# EAGLE schematic mixer (EAGLE 9.6.2)
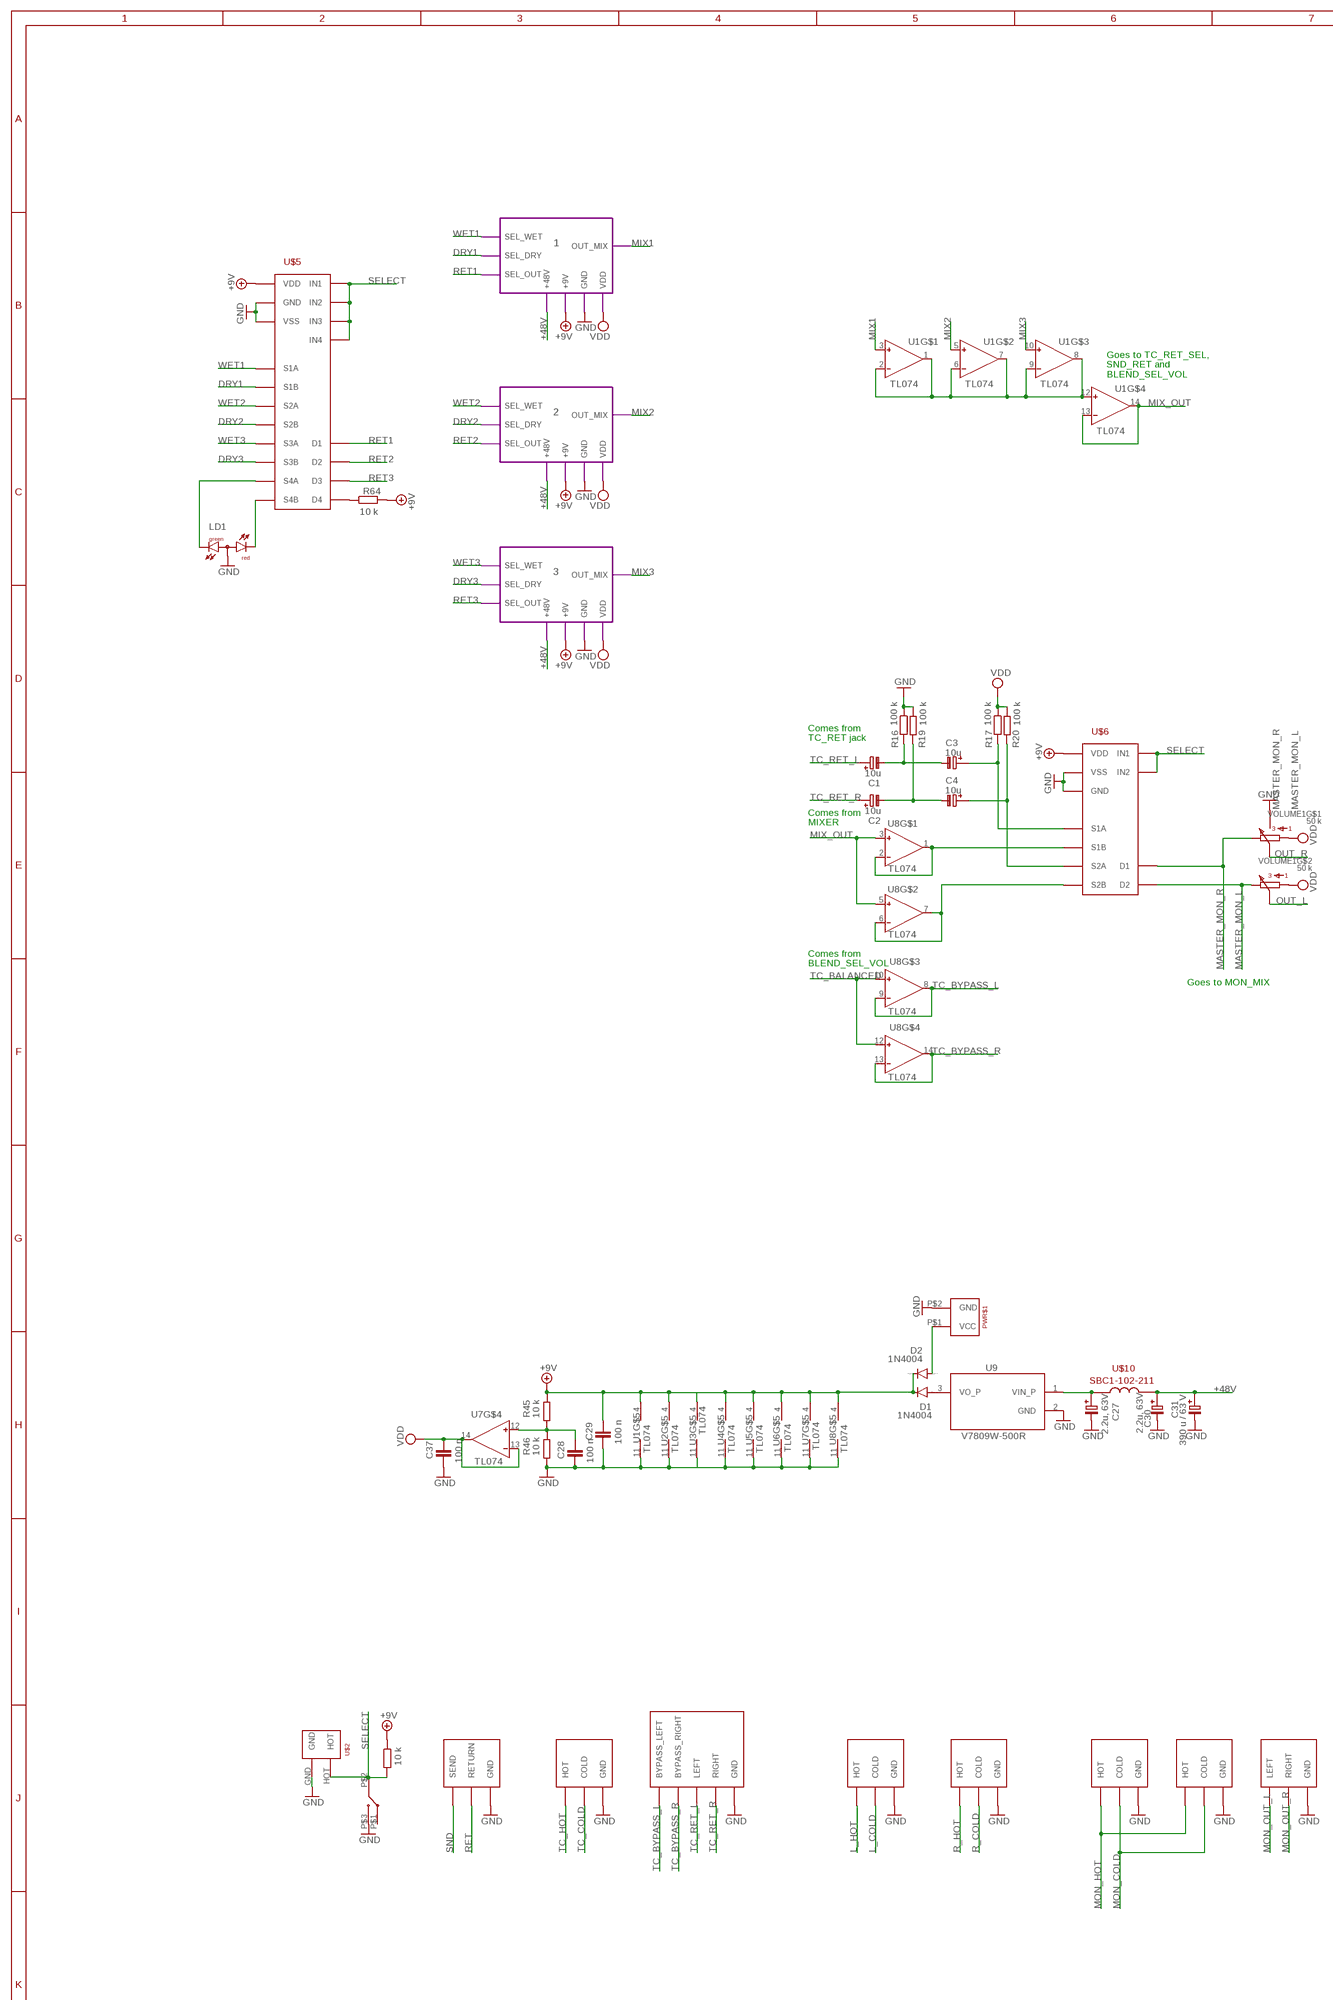
[diagram p0: schematic, sheet 1, part 1 of 3]
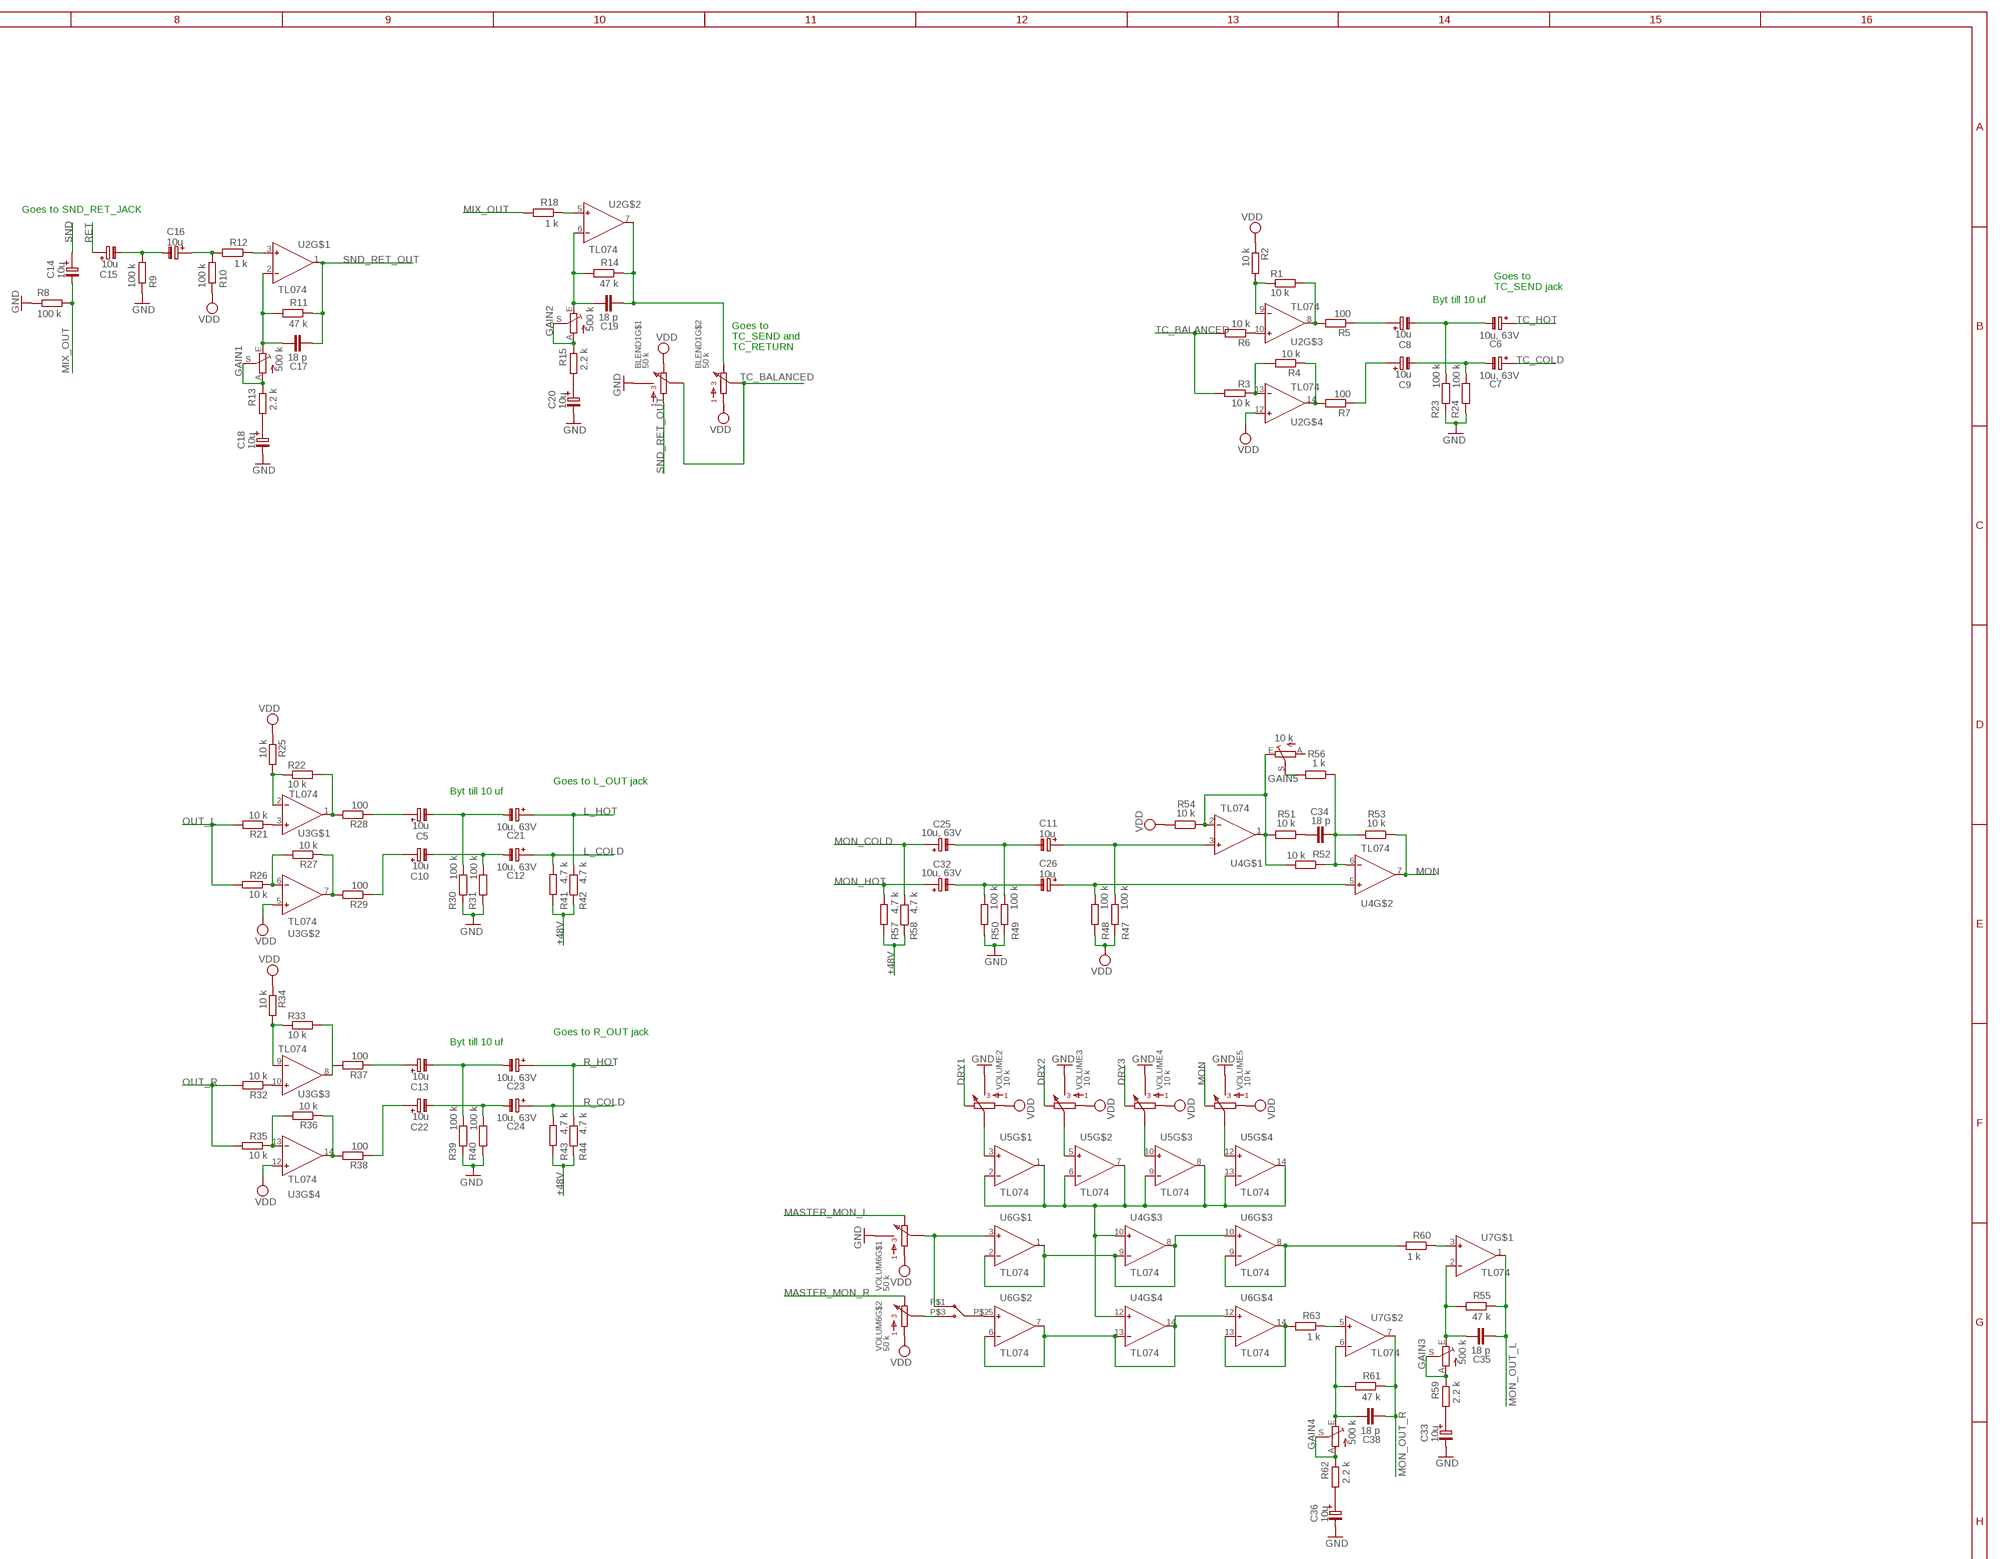
[diagram p1: schematic, sheet 1, part 2 of 3]
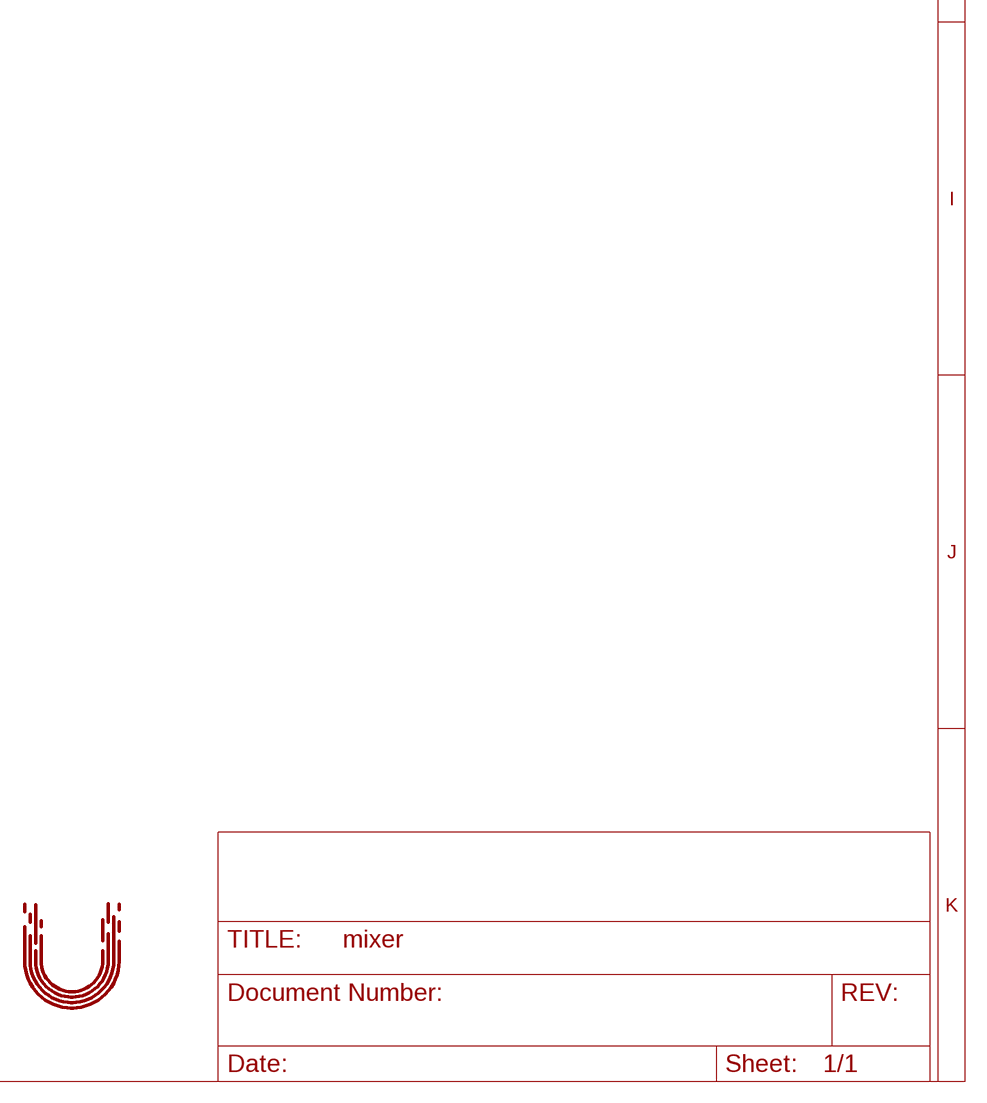
[diagram p2: schematic, sheet 1, part 3 of 3]

## Parts
BLEND1  50 k  RK09L124000Z  [RK09L124000Z]
BYPASS  BUTTON  [3-HOLES]
C1  10u  C-PR-2,0X5  [E2,0-5]
C2  10u  C-PR-2,0X5  [E2,0-5]
C3  10u  C-PR-2,0X5  [E2,0-5]
C4  10u  C-PR-2,0X5  [E2,0-5]
C5  10u  C-PR-2,0X5  [E2,0-5]
C6  10u, 63V  C-PR-2,0X6  [E2,0-6]
C7  10u, 63V  C-PR-2,0X6  [E2,0-6]
C8  10u  C-PR-2,0X5  [E2,0-5]
C9  10u  C-PR-2,0X5  [E2,0-5]
C10  10u  C-PR-2,0X5  [E2,0-5]
C11  10u  C-PR-2,0X5  [E2,0-5]
C12  10u, 63V  C-PR-2,0X6  [E2,0-6]
C13  10u  C-PR-2,0X5  [E2,0-5]
C14  10u  C-PR-2,0X5  [E2,0-5]
C15  10u  C-PR-2,0X5  [E2,0-5]
C16  10u  C-PR-2,0X5  [E2,0-5]
C17  18 p  C-EU025-025X050  [C025-025X050]
C18  10u  C-PR-2,0X5  [E2,0-5]
C19  18 p  C-EU025-025X050  [C025-025X050]
C20  10u  C-PR-2,0X5  [E2,0-5]
C21  10u, 63V  C-PR-2,0X6  [E2,0-6]
C22  10u  C-PR-2,0X5  [E2,0-5]
C23  10u, 63V  C-PR-2,0X6  [E2,0-6]
C24  10u, 63V  C-PR-2,0X6  [E2,0-6]
C25  10u, 63V  C-PR-2,0X6  [E2,0-6]
C26  10u  C-PR-2,0X5  [E2,0-5]
C27  2.2u, 63V  C-PR-2,0X6  [E2,0-6]
C28  100 n  C-EU025-025X050  [C025-025X050]
C29  100 n  C-EU025-025X050  [C025-025X050]
C30  2.2u, 63V  C-PR-2,0X6  [E2,0-6]
C31  390 u / 63 V  C-PR-5,0X12,5  [E5,0-12,5]
C32  10u, 63V  C-PR-2,0X6  [E2,0-6]
C33  10u  C-PR-2,0X5  [E2,0-5]
C34  18 p  C-EU025-025X050  [C025-025X050]
C35  18 p  C-EU025-025X050  [C025-025X050]
C36  10u  C-PR-2,0X5  [E2,0-5]
C37  100 n  C-EU025-025X050  [C025-025X050]
C38  18 p  C-EU025-025X050  [C025-025X050]
D1  1N4004  [DO41-10]
D2  1N4004  [DO41-10]
GAIN1  500 k  TRIM_EU-RJ9W  [RJ9W]
GAIN2  500 k  TRIM_EU-RJ9W  [RJ9W]
GAIN3  500 k  TRIM_EU-RJ9W  [RJ9W]
GAIN4  500 k  TRIM_EU-RJ9W  [RJ9W]
GAIN5  10 k  TRIM_EU-RJ9W  [RJ9W]
LD1  DUOLED-RG-A  [DUOLED-A-5MM]
LOOPMASTER  SEND_RETURN  [SND_RET]
MON_IN  HOT_COLD  [HOT_COLD]
MON_OUT  LEFT_RIGHT  [LEFT_RIGHT]
MON_THROUGH  HOT_COLD  [HOT_COLD]
MONO  BUTTON  [3-HOLES]
OUT_L  HOT_COLD  [HOT_COLD]
OUT_R  HOT_COLD  [HOT_COLD]
PWR$1  PWR  [PWR]
R1  10 k  R-EU_0204/7  [0204/7]
R2  10 k  R-EU_0204/7  [0204/7]
R3  10 k  R-EU_0204/7  [0204/7]
R4  10 k  R-EU_0204/7  [0204/7]
R5  100  R-EU_0204/7  [0204/7]
R6  10 k  R-EU_0204/7  [0204/7]
R7  100  R-EU_0204/7  [0204/7]
R8  100 k  R-EU_0204/7  [0204/7]
R9  100 k  R-EU_0204/7  [0204/7]
R10  100 k  R-EU_0204/7  [0204/7]
R11  47 k  R-EU_0204/7  [0204/7]
R12  1 k  R-EU_0204/7  [0204/7]
R13  2.2 k  R-EU_0204/7  [0204/7]
R14  47 k  R-EU_0204/7  [0204/7]
R15  2.2 k  R-EU_0204/7  [0204/7]
R16  100 k  R-EU_0204/7  [0204/7]
R17  100 k  R-EU_0204/7  [0204/7]
R18  1 k  R-EU_0204/7  [0204/7]
R19  100 k  R-EU_0204/7  [0204/7]
R20  100 k  R-EU_0204/7  [0204/7]
R21  10 k  R-EU_0204/7  [0204/7]
R22  10 k  R-EU_0204/7  [0204/7]
R23  100 k  R-EU_0204/7  [0204/7]
R24  100 k  R-EU_0204/7  [0204/7]
R25  10 k  R-EU_0204/7  [0204/7]
R26  10 k  R-EU_0204/7  [0204/7]
R27  10 k  R-EU_0204/7  [0204/7]
R28  100  R-EU_0204/7  [0204/7]
R29  100  R-EU_0204/7  [0204/7]
R30  100 k  R-EU_0204/7  [0204/7]
R31  100 k  R-EU_0204/7  [0204/7]
R32  10 k  R-EU_0204/7  [0204/7]
R33  10 k  R-EU_0204/7  [0204/7]
R34  10 k  R-EU_0204/7  [0204/7]
R35  10 k  R-EU_0204/7  [0204/7]
R36  10 k  R-EU_0204/7  [0204/7]
R37  100  R-EU_0204/7  [0204/7]
R38  100  R-EU_0204/7  [0204/7]
R39  100 k  R-EU_0204/7  [0204/7]
R40  100 k  R-EU_0204/7  [0204/7]
R41  4.7 k  R-EU_0204/7  [0204/7]
R42  4.7 k  R-EU_0204/7  [0204/7]
R43  4.7 k  R-EU_0204/7  [0204/7]
R44  4.7 k  R-EU_0204/7  [0204/7]
R45  10 k  R-EU_0204/7  [0204/7]
R46  10 k  R-EU_0204/7  [0204/7]
R47  100 k  R-EU_0204/7  [0204/7]
R48  100 k  R-EU_0204/7  [0204/7]
R49  100 k  R-EU_0204/7  [0204/7]
R50  100 k  R-EU_0204/7  [0204/7]
R51  10 k  R-EU_0204/7  [0204/7]
R52  10 k  R-EU_0204/7  [0204/7]
R53  10 k  R-EU_0204/7  [0204/7]
R54  10 k  R-EU_0204/7  [0204/7]
R55  47 k  R-EU_0204/7  [0204/7]
R56  1 k  R-EU_0204/7  [0204/7]
R57  4.7 k  R-EU_0204/7  [0204/7]
R58  4.7 k  R-EU_0204/7  [0204/7]
R59  2.2 k  R-EU_0204/7  [0204/7]
R60  1 k  R-EU_0204/7  [0204/7]
R61  47 k  R-EU_0204/7  [0204/7]
R62  2.2 k  R-EU_0204/7  [0204/7]
R63  1 k  R-EU_0204/7  [0204/7]
R64  10 k  R-EU_0204/7  [0204/7]
R65  10 k  R-EU_0204/7  [0204/7]
TC_RET  LEFT_RIGHT_BYPASS  [LEFT_RIGHT_BYPASS]
TC_SEND_JACK  HOT_COLD  [HOT_COLD]
U1  TL074  TL074IDTPDIP-14  [DIP762W53P254L1969H508Q14B]
U2  TL074  TL074IDTPDIP-14  [DIP762W53P254L1969H508Q14B]
U3  TL074  TL074IDTPDIP-14  [DIP762W53P254L1969H508Q14B]
U4  TL074  TL074IDTPDIP-14  [DIP762W53P254L1969H508Q14B]
U5  TL074  TL074IDTPDIP-14  [DIP762W53P254L1969H508Q14B]
U6  TL074  TL074IDTPDIP-14  [DIP762W53P254L1969H508Q14B]
U7  TL074  TL074IDTPDIP-14  [DIP762W53P254L1969H508Q14B]
U8  TL074  TL074IDTPDIP-14  [DIP762W53P254L1969H508Q14B]
U9  V7809W-500R  [CONV_V7809W-500R]
U$1  UTBULT_DESIGN3  [UD_3]
U$2  UNBALANCED_INPUT_JACK  [BALANCED_INPUT_JACK]
U$5  ADG333ABNZADG333ABNZ  [DIP762W53P254L2591H508Q20B]
U$6  ADG436BNZADG436BNZ  [DIP762W53P254L2006H508Q16B]
U$10  SBC1-102-211  [SBC1-102-211]
VOLUM6  50 k  RK09L124000Z  [RK09L124000Z]
VOLUME1  50 k  RK09L124000Z  [RK09L124000Z]
VOLUME2  10 k  RK09L1140  [RK09L1140]
VOLUME3  10 k  RK09L1140  [RK09L1140]
VOLUME4  10 k  RK09L1140  [RK09L1140]
VOLUME5  10 k  RK09L1140  [RK09L1140]

## Module instances
1 = C
2 = C
3 = C

## Nets
+9V: C29.1 D1.C D2.C R45.1 R64.2 R65.1 U1.4(V+) U2.4(V+) U3.4(V+) U4.4(V+) U5.4(V+) U6.4(V+) U7.4(V+) U8.4(V+) U$5.VDD U$6.VDD ; port 1.+9V 2.+9V 3.+9V
+48V: C30.+ C31.+ R41.1 R42.1 R43.1 R44.1 R57.1 R58.1 U$10.P$2 ; port 1.+48V 2.+48V 3.+48V
COLD_SEND: C11.+ R47.2 U4.3(IN+)
DRY1: U$5.S1B VOLUME2.P$3 ; port 1.SEL_DRY
DRY2: U$5.S2B VOLUME3.P$3 ; port 2.SEL_DRY
DRY3: U$5.S3B VOLUME4.P$3 ; port 3.SEL_DRY
GND: BLEND1.P$4 BLEND1.P$5 BYPASS.P$3 C18.- C20.- C27.- C28.2 C29.2 C30.- C31.- C33.- C36.- C37.2 LD1.A LOOPMASTER.P$1(GND) MON_IN.P$1(GND) MON_OUT.P$1(GND) MON_THROUGH.P$1(GND) OUT_L.P$1(GND) OUT_R.P$1(GND) PWR$1.P$2(GND) R8.1 R9.1 R16.1 R19.1 R23.1 R24.1 R30.1 R31.1 R39.1 R40.1 R46.2 R49.1 R50.1 TC_RET.GND TC_SEND_JACK.P$1(GND) U1.11(V-) U2.11(V-) U3.11(V-) U4.11(V-) U5.11(V-) U6.11(V-) U7.11(V-) U8.11(V-) U9.2(GND) U$2.GND U$5.GND U$5.VSS U$6.GND U$6.VSS VOLUM6.P$4 VOLUM6.P$5 VOLUME1.P$4 VOLUME1.P$5 VOLUME2.P$4 VOLUME2.P$5 VOLUME3.P$4 VOLUME3.P$5 VOLUME4.P$4 VOLUME4.P$5 VOLUME5.P$4 VOLUME5.P$5 ; port 1.GND 2.GND 3.GND
HOT_SEND: C26.+ R48.2 U4.5(IN+)
L_COLD: C12.+ OUT_L.P$3(COLD) R41.2
L_HOT: C21.+ OUT_L.P$2(HOT) R42.2
MASTER_MON_L: U$6.D2 VOLUM6.P$3 VOLUME1.P$8
MASTER_MON_R: U$6.D1 VOLUM6.P$8 VOLUME1.P$3
MIX1: U1.3(IN+) ; port 1.OUT_MIX
MIX2: U1.5(IN+) ; port 2.OUT_MIX
MIX3: U1.10(IN+) ; port 3.OUT_MIX
MIX_OUT: C14.- R8.2 R18.2 U1.13(IN-) U1.14(OUT) U8.3(IN+) U8.5(IN+)
MON: R53.1 U4.7(OUT) VOLUME5.P$3
MON_COLD: C25.+ MON_IN.P$3(COLD) MON_THROUGH.P$3(COLD) R58.2
MON_HOT: C32.+ MON_IN.P$2(HOT) MON_THROUGH.P$2(HOT) R57.2
MON_OUT_L: C35.1 MON_OUT.P$2(LEFT) R55.1 U7.1(OUT)
MON_OUT_R: C38.1 MON_OUT.P$3(RIGHT) R61.1 U7.7(OUT)
N$1: R1.1 R2.2 U2.9(IN-)
N$2: R6.1 U2.10(IN+)
N$3: R1.2 R5.2 U2.8(OUT)
N$4: U1.1(OUT) U1.2(IN-) U1.6(IN-) U1.7(OUT) U1.8(OUT) U1.9(IN-) U1.12(IN+)
N$5: R3.1 R4.2 U2.13(IN-)
N$6: R4.1 R7.2 U2.14(OUT)
N$7: C8.+ R5.1
N$8: C9.+ R7.1
N$9: C1.- C3.- R16.2
N$10: R21.1 U3.3(IN+)
N$12: C2.- C4.- R19.2
N$13: R22.2 R28.2 U3.1(OUT)
N$14: C6.- C8.- R23.2
N$15: C7.- C9.- R24.2
N$16: R22.1 R25.2 U3.2(IN-)
N$17: R26.1 R27.2 U3.6(IN-)
N$18: R27.1 R29.2 U3.7(OUT)
N$19: C5.- C21.- R30.2
N$20: C10.- C12.- R31.2
N$21: C5.+ R28.1
N$22: C10.+ R29.1
N$23: GAIN1.A GAIN1.S R13.1
N$24: R32.1 U3.10(IN+)
N$25: C11.- C25.- R49.2
N$26: C15.- C16.- R9.2
N$27: C26.- C32.- R50.2
N$28: C16.+ R10.2 R12.2
N$29: C17.2 GAIN1.E R11.2 U2.2(IN-)
N$30: C19.2 GAIN2.E R14.2 U2.6(IN-)
N$31: GAIN2.A GAIN2.S R15.1
N$32: C18.+ R13.2
N$33: R12.1 U2.3(IN+)
N$34: GAIN4.A GAIN4.S R62.1
N$35: C20.+ R15.2
N$36: R18.1 U2.5(IN+)
N$37: BLEND1.P$8 C19.1 R14.1 U2.7(OUT)
N$38: R33.2 R37.2 U3.8(OUT)
N$39: R33.1 R34.2 U3.9(IN-)
N$40: R35.1 R36.2 U3.13(IN-)
N$41: R36.1 R38.2 U3.14(OUT)
N$42: C13.- C23.- R39.2
N$43: C22.- C24.- R40.2
N$44: C13.+ R37.1
N$45: C22.+ R38.1
N$46: GAIN5.E R51.2 R52.2 R54.1 U4.1(OUT) U4.2(IN-)
N$47: C34.1 R51.1
N$48: C34.2 R52.1 R53.2 R56.1 U4.6(IN-)
N$49: U4.8(OUT) U4.9(IN-) U6.1(OUT) U6.2(IN-) U6.10(IN+)
N$50: GAIN5.S R56.2
N$51: MONO.P$1 U6.3(IN+) VOLUM6.P$2
N$52: U4.13(IN-) U4.14(OUT) U6.6(IN-) U6.7(OUT) U6.12(IN+)
N$53: U5.3(IN+) VOLUME2.P$2
N$54: U5.5(IN+) VOLUME3.P$2
N$55: U5.10(IN+) VOLUME4.P$2
N$56: U5.12(IN+) VOLUME5.P$2
N$57: U4.10(IN+) U4.12(IN+) U5.1(OUT) U5.2(IN-) U5.6(IN-) U5.7(OUT) U5.8(OUT) U5.9(IN-) U5.13(IN-) U5.14(OUT)
N$58: MONO.P$2 U6.5(IN+)
N$59: R63.2 U6.13(IN-) U6.14(OUT)
N$60: R60.2 U6.8(OUT) U6.9(IN-)
N$62: GAIN3.A GAIN3.S R59.1
N$63: C33.+ R59.2
N$64: R60.1 U7.3(IN+)
N$65: U8.1(OUT) U8.2(IN-) U$6.S1B
N$66: C38.2 GAIN4.E R61.2 U7.6(IN-)
N$67: C35.2 GAIN3.E R55.2 U7.2(IN-)
N$68: C36.+ R62.2
N$69: R63.1 U7.5(IN+)
N$70: D1.A U9.3(VO_P)
N$71: U8.6(IN-) U8.7(OUT) U$6.S2B
N$72: MONO.P$3 VOLUM6.P$7
N$73: C28.1 R45.2 R46.1 U7.12(IN+)
N$74: LD1.CR U$5.S4B
N$75: LD1.CX(CG) U$5.S4A
N$76: R64.1 U$5.D4
N$79: C27.+ U9.1(VIN_P) U$10.P$1
N$81: D2.A PWR$1.P$1(VCC)
OUT_L: R21.2 R26.2 VOLUME1.P$7
OUT_R: R32.2 R35.2 VOLUME1.P$2
R_COLD: C24.+ OUT_R.P$3(COLD) R43.2
R_HOT: C23.+ OUT_R.P$2(HOT) R44.2
RET: C15.+ LOOPMASTER.P$2(RETURN)
RET1: U$5.D1 ; port 1.SEL_OUT
RET2: U$5.D2 ; port 2.SEL_OUT
RET3: U$5.D3 ; port 3.SEL_OUT
SELECT: BYPASS.P$2 R65.2 U$2.HOT U$5.IN1 U$5.IN2 U$5.IN3 U$5.IN4 U$6.IN1 U$6.IN2
SND: C14.+ LOOPMASTER.P$3(SEND)
SND_RET_OUT: BLEND1.P$1 C17.1 R11.1 U2.1(OUT)
TC_BALANCED: BLEND1.P$2 BLEND1.P$7 R3.2 R6.2 U8.10(IN+) U8.12(IN+)
TC_BYPASS_L: TC_RET.BPSR(BYPASS_LEFT) U8.8(OUT) U8.9(IN-)
TC_BYPASS_R: TC_RET.BPSL(BYPASS_RIGHT) U8.13(IN-) U8.14(OUT)
TC_COLD: C7.+ TC_SEND_JACK.P$3(COLD)
TC_HOT: C6.+ TC_SEND_JACK.P$2(HOT)
TC_RET_L: C1.+ TC_RET.LEFT
TC_RET_R: C2.+ TC_RET.RIGHT
TC_WET_L: C3.+ R17.2 U$6.S1A
TC_WET_R: C4.+ R20.2 U$6.S2A
VDD: BLEND1.P$3 BLEND1.P$6 C37.1 R2.1 R10.1 R17.1 R20.1 R25.1 R34.1 R47.1 R48.1 R54.2 U2.12(IN+) U3.5(IN+) U3.12(IN+) U7.13(IN-) U7.14(OUT) VOLUM6.P$1 VOLUM6.P$6 VOLUME1.P$1 VOLUME1.P$6 VOLUME2.P$1 VOLUME3.P$1 VOLUME4.P$1 VOLUME5.P$1 ; port 1.VDD 2.VDD 3.VDD
WET1: U$5.S1A ; port 1.SEL_WET
WET2: U$5.S2A ; port 2.SEL_WET
WET3: U$5.S3A ; port 3.SEL_WET
Unconnected: BYPASS.P$1 GAIN5.A U7.8(OUT) U7.9(IN-) U7.10(IN+)

## Notes on the sheet
- Goes to SND_RET_JACK
- Goes to 
  TC_SEND jack
- Byt till 10 uf
- Goes to 
  TC_SEND and
  TC_RETURN
- Goes to TC_RET_SEL,
  SND_RET and 
  BLEND_SEL_VOL
- Goes to L_OUT jack
- Comes from
  TC_RET jack
- Byt till 10 uf
- Comes from
  MIXER
- Comes from
  BLEND_SEL_VOL
- Goes to R_OUT jack
- Goes to MON_MIX | Byt till 10 uf

## Library data of the parts
BLEND1 VOLUME1 = passives:RK09L124000Z: RK09L1140 Potentiometer; LINK: https://www.mouser.se/ProductDetail/Alps-Alpine/RK09L124000Z?qs=fQ8kcZGzY5XvGyzlPd%2FK1w%3D%3D
BYPASS MONO = connectors:BUTTON
C1-C16 C18 C20-C27 C30-C33 C36 = passives:C-PR: POLARIZED ELECTROLYTIC/TANTALUM
C17 C19 C28 C29 C34 C35 C37 C38 = passives:C-EU: CAPACITOR, European symbol; SPICEPREFIX: C
D1 D2 = passives:1N4004: DIODE general purpose rectifier, 1 A
GAIN1-GAIN5 = passives:TRIM_EU-: POTENTIOMETER
LD1 = passives:DUOLED-RG-A: DUO LED 2 colors (red/green), 5 mm, round, common Anode www.ligitek.com or other producers.
LOOPMASTER = connectors:SEND_RETURN
MON_IN MON_THROUGH OUT_L OUT_R TC_SEND_JACK = connectors:HOT_COLD
MON_OUT = connectors:LEFT_RIGHT
PWR$1 = connectors:PWR
R1-R65 = passives:R-EU_: RESISTOR, European symbol; SPICEPREFIX: R
TC_RET = connectors:LEFT_RIGHT_BYPASS
U1-U8 = ic:TL074IDT: Low noise JFET quad operational amplifier; LINK: https://eu.mouser.com/ProductDetail/Texas-Instruments/TL074CN?qs=%2Fha2pyFadui04%2FQQ4Z%2F%252B8cpHvrlLCfjGhhp9sdrT5Zo%3D; MPN: TL074CN; SUPPLIER: Mouser
U9 = power:V7809W-500R: V7809W-500R Power regulator Input up to 72 V, output 9 V 500 mA; LINK: https://eu.mouser.com/ProductDetail/CUI-Inc/V7809W-500R?qs=WyjlAZoYn50ZQqVm%2FTcinw%3D%3D; MPN: V7809W-500R; SUPPLIER: Mouser
U$1 = misc:UTBULT_DESIGN
U$2 = connectors:UNBALANCED_INPUT_JACK
U$5 = ic:ADG333ABNZ: ADG333ABNZ Analog selector 4 channel, +-44 V Connects B on logical 0, and A on logical 1; LINK: https://www.mouser.se/ProductDetail/Analog-Devices/ADG333ABNZ?qs=BpaRKvA4VqF%252BfFFtqT1yFg%3D%3D; MPN: ADG333ABNZ; SUPPLIER: Mouser
U$6 = ic:ADG436BNZ: ADG436BNZ Analog selector 2 channel, +-44 V Connects B on logical 0, and A on logical 1
U$10 = passives:SBC1-102-211: SBC1-102-211 - Inductor 1 mH 210 mA
VOLUM6 = passives:RK09L124000Z: RK09L1140 Potentiometer
VOLUME2-VOLUME5 = passives:RK09L1140: RK09L1140 Potentiometer

## Module C
Ports: SEL_WET(io) SEL_DRY(io) SEL_OUT(io) OUT_MIX(io) VDD(io) GND(io) +9V(io) +48V(io)
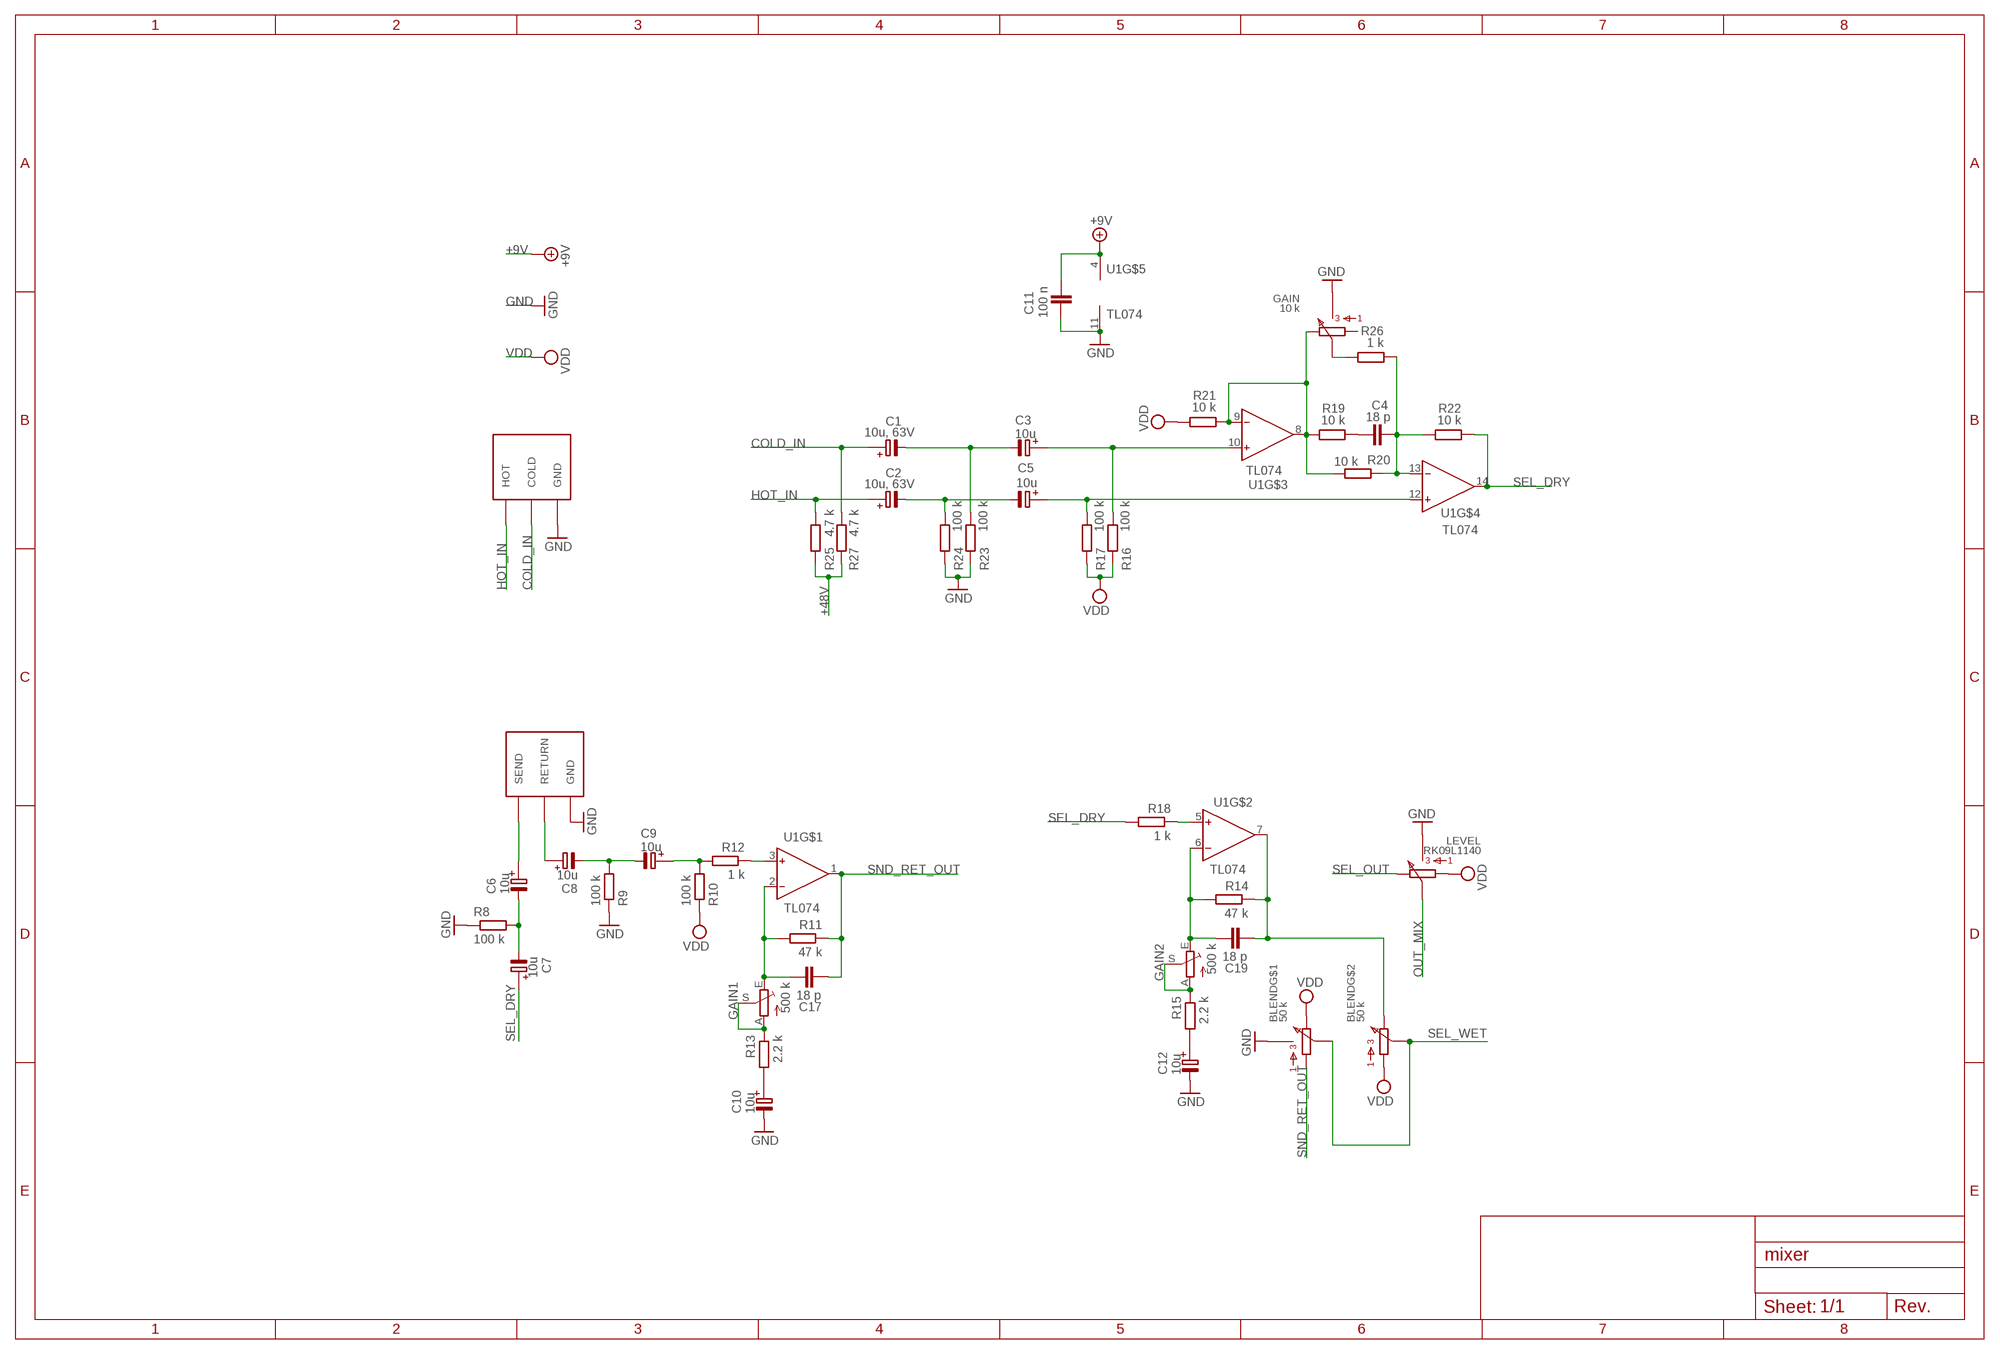
[diagram p3: schematic, module C, sheet 1]

### Parts
BLEND  50 k  RK09L124000Z  [RK09L124000Z]
C1  10u, 63V  C-PR-2,0X6  [E2,0-6]
C2  10u, 63V  C-PR-2,0X6  [E2,0-6]
C3  10u  C-PR-2,0X5  [E2,0-5]
C4  18 p  C-EU025-025X050  [C025-025X050]
C5  10u  C-PR-2,0X5  [E2,0-5]
C6  10u  C-PR-2,0X5  [E2,0-5]
C7  10u  C-PR-2,0X5  [E2,0-5]
C8  10u  C-PR-2,0X5  [E2,0-5]
C9  10u  C-PR-2,0X5  [E2,0-5]
C10  10u  C-PR-2,0X5  [E2,0-5]
C11  100 n  C-EU025-025X050  [C025-025X050]
C12  10u  C-PR-2,0X5  [E2,0-5]
C17  18 p  C-EU025-025X050  [C025-025X050]
C19  18 p  C-EU025-025X050  [C025-025X050]
GAIN  10 k  RK09L1140  [RK09L1140]
GAIN1  500 k  TRIM_EU-RJ9W  [RJ9W]
GAIN2  500 k  TRIM_EU-RJ9W  [RJ9W]
IN  HOT_COLD  [HOT_COLD]
LEVEL  RK09L1140  [RK09L1140]
R8  100 k  R-EU_0204/7  [0204/7]
R9  100 k  R-EU_0204/7  [0204/7]
R10  100 k  R-EU_0204/7  [0204/7]
R11  47 k  R-EU_0204/7  [0204/7]
R12  1 k  R-EU_0204/7  [0204/7]
R13  2.2 k  R-EU_0204/7  [0204/7]
R14  47 k  R-EU_0204/7  [0204/7]
R15  2.2 k  R-EU_0204/7  [0204/7]
R16  100 k  R-EU_0204/7  [0204/7]
R17  100 k  R-EU_0204/7  [0204/7]
R18  1 k  R-EU_0204/7  [0204/7]
R19  10 k  R-EU_0204/7  [0204/7]
R20  10 k  R-EU_0204/7  [0204/7]
R21  10 k  R-EU_0204/7  [0204/7]
R22  10 k  R-EU_0204/7  [0204/7]
R23  100 k  R-EU_0204/7  [0204/7]
R24  100 k  R-EU_0204/7  [0204/7]
R25  4.7 k  R-EU_0204/7  [0204/7]
R26  1 k  R-EU_0204/7  [0204/7]
R27  4.7 k  R-EU_0204/7  [0204/7]
U1  TL074  TL074IDTPDIP-14  [DIP762W53P254L1969H508Q14B]
U2  SEND_RETURN  [SND_RET]

### Nets
+9V: C11.2 U1.4(V+)
+48V: R25.1 R27.1
COLD_IN: C1.+ IN.P$3(COLD) R27.2
COLD_SEND: C3.+ R16.2 U1.10(IN+)
GND: BLEND.P$4 BLEND.P$5 C10.- C12.- GAIN.P$4 GAIN.P$5 IN.P$1(GND) LEVEL.P$4 LEVEL.P$5 R8.1 R9.1 R23.1 R24.1 U2.P$1(GND)
HOT_IN: C2.+ IN.P$2(HOT) R25.2
HOT_SEND: C5.+ R17.2 U1.12(IN+)
N$1: C10.+ R13.2
N$2: C12.+ R15.2
N$3: GAIN1.A GAIN1.S R13.1
N$4: GAIN2.A GAIN2.S R15.1
N$9: GAIN.P$3 R19.2 R20.2 R21.1 U1.8(OUT) U1.9(IN-)
N$11: C4.1 R19.1
N$12: C4.2 R20.1 R22.2 R26.1 U1.13(IN-)
N$14: C1.- C3.- R23.2
N$15: C2.- C5.- R24.2
N$17: GAIN.P$2 R26.2
N$23: C6.- C7.- R8.2
N$24: C11.1 U1.11(V-) ; supply symbol labelled GND
N$25: C6.+ U2.P$3(SEND)
N$26: C8.- C9.- R9.2
N$27: C8.+ U2.P$2(RETURN)
N$28: C9.+ R10.2 R12.2
N$29: C17.2 GAIN1.E R11.2 U1.2(IN-)
N$30: C19.2 GAIN2.E R14.2 U1.6(IN-)
N$33: R12.1 U1.3(IN+)
N$36: R18.1 U1.5(IN+)
N$37: BLEND.P$8 C19.1 R14.1 U1.7(OUT)
OUT_MIX: LEVEL.P$2
SEL_DRY: C7.+ R18.2 R22.1 U1.14(OUT)
SEL_OUT: LEVEL.P$3
SEL_WET: BLEND.P$2 BLEND.P$7
SND_RET_OUT: BLEND.P$1 C17.1 R11.1 U1.1(OUT)
VDD: BLEND.P$3 BLEND.P$6 LEVEL.P$1 R10.1 R16.1 R17.1 R21.2
Unconnected: GAIN.P$1

### Library data of the parts
BLEND = passives:RK09L124000Z: RK09L1140 Potentiometer; LINK: https://www.mouser.se/ProductDetail/Alps-Alpine/RK09L124000Z?qs=fQ8kcZGzY5XvGyzlPd%2FK1w%3D%3D
C1-C3 C5-C10 C12 = passives:C-PR: POLARIZED ELECTROLYTIC/TANTALUM
C4 C11 C17 C19 = passives:C-EU: CAPACITOR, European symbol; SPICEPREFIX: C
GAIN LEVEL = passives:RK09L1140: RK09L1140 Potentiometer
GAIN1 GAIN2 = passives:TRIM_EU-: POTENTIOMETER
IN = connectors:HOT_COLD
R8-R27 = passives:R-EU_: RESISTOR, European symbol; SPICEPREFIX: R
U1 = ic:TL074IDT: Low noise JFET quad operational amplifier; LINK: https://eu.mouser.com/ProductDetail/Texas-Instruments/TL074CN?qs=%2Fha2pyFadui04%2FQQ4Z%2F%252B8cpHvrlLCfjGhhp9sdrT5Zo%3D; MPN: TL074CN; SUPPLIER: Mouser
U2 = connectors:SEND_RETURN